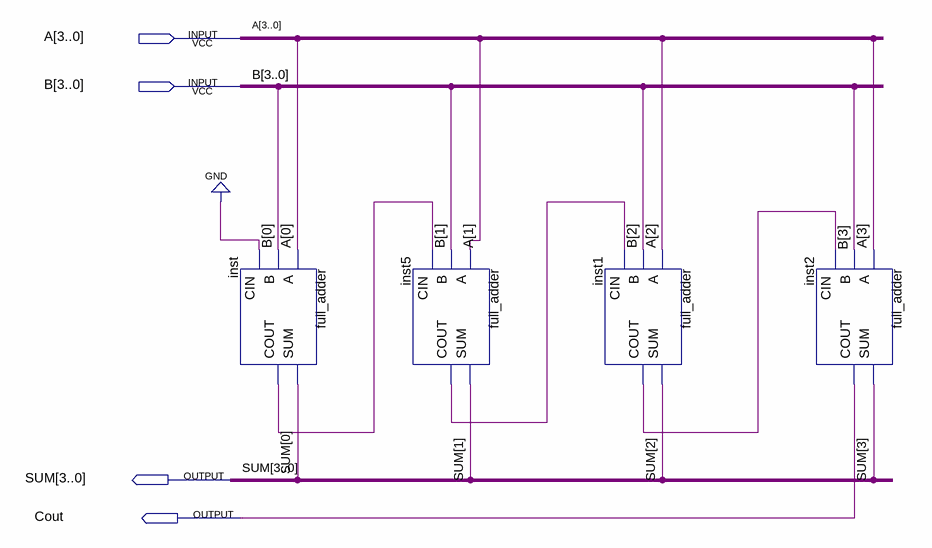
[diagram p0: schematic sheet]
// Quartus schematic FA_4bit.bdf as structural Verilog: 4 symbols, 4 pins
module FA_4bit (
  input  [3:0] A,
  input  [3:0] B,
  output [3:0] SUM,
  output Cout
);

  wire inst1_cout, inst5_cout, inst_cout;

  full_adder inst (.A(A[0]), .B(B[0]), .CIN(1'b0), .SUM(SUM[0]), .COUT(inst_cout));
  full_adder inst5 (.A(A[1]), .B(B[1]), .CIN(inst_cout), .SUM(SUM[1]), .COUT(inst5_cout));
  full_adder inst1 (.A(A[2]), .B(B[2]), .CIN(inst5_cout), .SUM(SUM[2]), .COUT(inst1_cout));
  full_adder inst2 (.A(A[3]), .B(B[3]), .CIN(inst1_cout), .SUM(SUM[3]), .COUT(Cout));
endmodule
